# EAGLE schematic untitled (EAGLE 9.6.2)
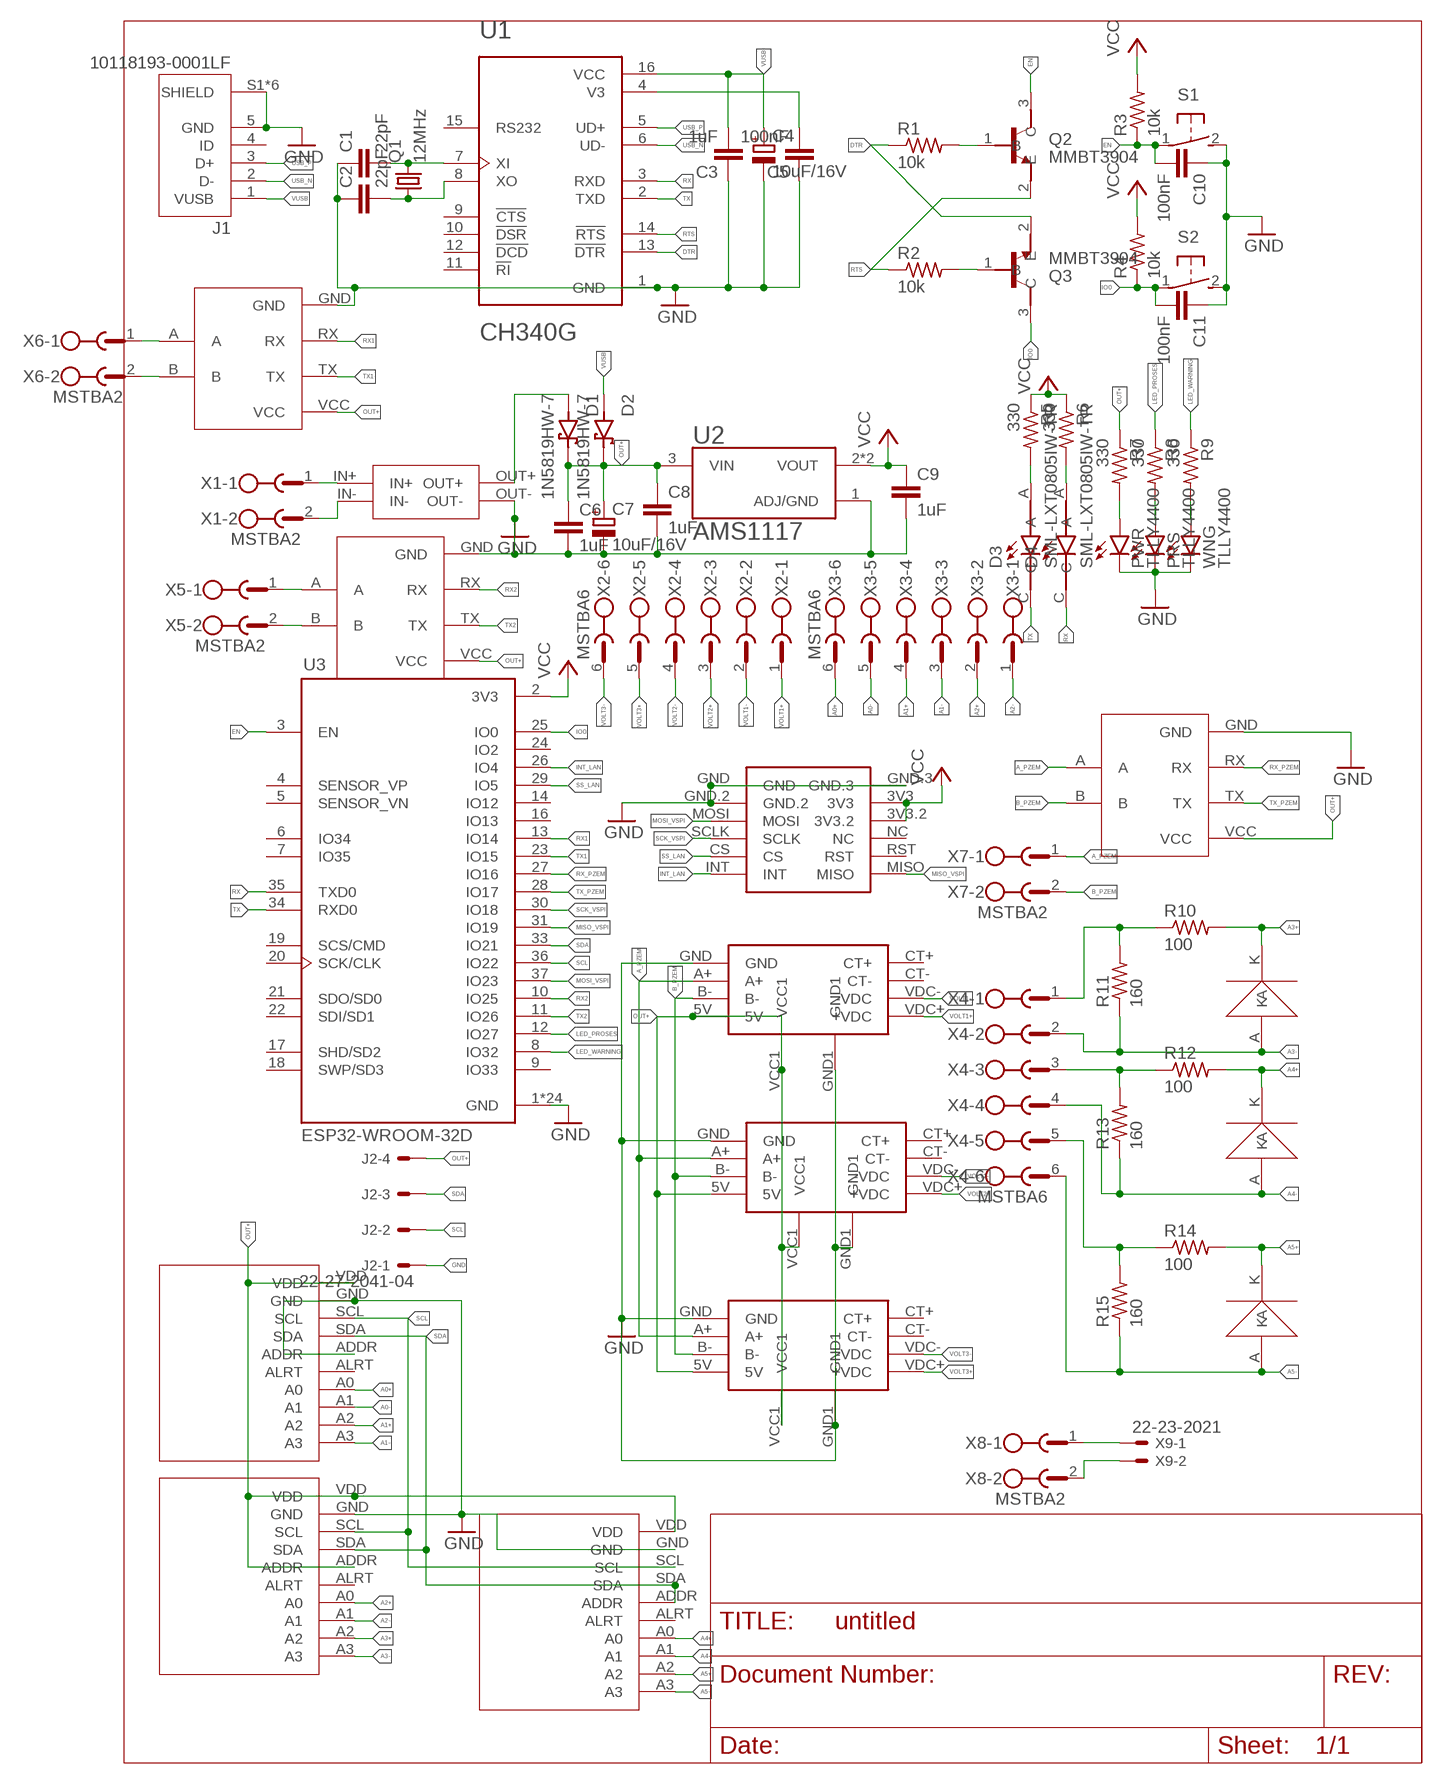
[diagram p0: schematic, sheet 1]

## Parts
ADS1  ADS1115  [ADS1115]
ADS2  ADS1115  [ADS1115]
ADS3  ADS1115  [ADS1115]
C1  22pF  C-EUC0805K  [C0805K]
C2  22pF  C-EUC0805K  [C0805K]
C3  1uF  C-EUC0805K  [C0805K]
C4  10uF/16V  CPOL-EU153CLV-0505  [153CLV-0505]
C5  100nF  C-EUC0805K  [C0805K]
C6  1uF  C-EUC0805K  [C0805K]
C7  10uF/16V  CPOL-EU153CLV-0505  [153CLV-0505]
C8  1uF  C-EUC0805K  [C0805K]
C9  1uF  C-EUC0805K  [C0805K]
C10  100nF  C-EUC0805K  [C0805K]
C11  100nF  C-EUC0805K  [C0805K]
D1  1N5819HW-7  [SOD3715X145N]
D2  1N5819HW-7  [SOD3715X145N]
D3  SML-LXT0805IW-TR  [LEDC2012X120N]
D4  SML-LXT0805IW-TR  [LEDC2012X120N]
J1  10118193-0001LF  [FCI_10118193-0001LF]
J2  22-27-2041-04  [6410-04]
MINI1  MINI560  [MINI560]
PRS  TLLY4400  [LED3MM]
PWR  TLLY4400  [LED3MM]
PZEM-DC1  PZEM-DC  [PZEM-DC]
PZEM-DC2  PZEM-DC  [PZEM-DC]
PZEM-DC3  PZEM-DC  [PZEM-DC]
Q1  12MHz  CRYSTALSM49  [SM49]
Q2  MMBT3904  [SOT95P240X120-3N]
Q3  MMBT3904  [SOT95P240X120-3N]
R1  10k  R-US_M0805  [M0805]
R2  10k  R-US_M0805  [M0805]
R3  10k  R-US_M0805  [M0805]
R4  10k  R-US_M0805  [M0805]
R5  330  R-US_M0805  [M0805]
R6  330  R-US_M0805  [M0805]
R7  330  R-US_M0805  [M0805]
R8  330  R-US_M0805  [M0805]
R9  330  R-US_M0805  [M0805]
R10  100  R-US_M0805  [M0805]
R11  160  R-US_M0805  [M0805]
R12  100  R-US_M0805  [M0805]
R13  160  R-US_M0805  [M0805]
R14  100  R-US_M0805  [M0805]
R15  160  R-US_M0805  [M0805]
S1  31-XX  [B3F-31XX]
S2  31-XX  [B3F-31XX]
TTL-RS1  TTL-RS485  [TTL-RS485]
TTL-RS2  TTL-RS485  [TTL-RS485]
TTL-RS3  TTL-RS485  [TTL-RS485]
U1  CH340G  [SOIC127P600X180-16N]
U2  AMS1117  [SOT229P700X180-4N]
U3  ESP32-WROOM-32D  [MODULE_ESP32-WROOM-32D]
U$1  MINI_W5500  [MINI_W5500]
WNG  TLLY4400  [LED3MM]
X1  MSTBA2  [MSTBA2]
X2  MSTBA6  [MSTBA6]
X3  MSTBA6  [MSTBA6]
X4  MSTBA6  [MSTBA6]
X5  MSTBA2  [MSTBA2]
X6  MSTBA2  [MSTBA2]
X7  MSTBA2  [MSTBA2]
X8  MSTBA2  [MSTBA2]
X9  22-23-2021  [22-23-2021]
ZENER3V1  3v3  ZENER3V3  [DIO_LL4148]
ZENER3V2  ZENER3V3  [DIO_LL4148]
ZENER3V3  ZENER3V3  [DIO_LL4148]

## Nets
A0+: ADS1.A0 X3.6
A0-: ADS1.A1 X3.5
A1+: ADS1.A2 X3.4
A1-: ADS1.A3 X3.3
A2+: ADS2.A0 X3.2
A2-: ADS2.A1 X3.1
A3+: ADS2.A2 R10.2 ZENER3V1.K
A3-: ADS2.A3 R11.1 X4.2 ZENER3V1.A
A4+: ADS3.A0 R12.2 ZENER3V2.K
A4-: ADS3.A1 R13.1 X4.4 ZENER3V2.A
A5+: ADS3.A2 R14.2 ZENER3V3.K
A5-: ADS3.A3 R15.1 X4.6 ZENER3V3.A
A_PZEM: PZEM-DC1.A+ PZEM-DC2.A+ PZEM-DC3.A+ TTL-RS1.A X7.1
B_PZEM: PZEM-DC1.B- PZEM-DC2.B- PZEM-DC3.B- TTL-RS1.B X7.2
DTR: Q3.2(E) R1.1 U1.13(!DTR)
EN: C10.2 Q2.3(C) R3.1 S1.1(P) U3.3(EN)
GND: ADS1.ADDR ADS1.GND ADS2.GND ADS3.GND C1.1 C2.1 C3.1 C4.- C5.1 C6.2 C7.- C8.2 C9.2 C10.1 C11.1 J1.5(GND) J1.S1(SHIELD) J1.S2(SHIELD) J1.S3(SHIELD) J1.S4(SHIELD) J1.S5(SHIELD) J1.S6(SHIELD) J2.1 MINI1.OUT- PRS.K(C) PWR.K(C) PZEM-DC1.GND PZEM-DC1.GND1 PZEM-DC2.GND PZEM-DC2.GND1 PZEM-DC3.GND PZEM-DC3.GND1 S1.2(S) S2.2(S) TTL-RS1.GND TTL-RS2.GND TTL-RS3.GND U1.1(GND) U2.1(ADJ/GND) U3.1(GND) U3.15(GND) U3.38(GND) U3.39_1(GND) U3.39_2(GND) U3.39_3(GND) U3.39_4(GND) U3.39_5(GND) U3.39_6(GND) U3.39_7(GND) U3.39_8(GND) U3.39_9(GND) U3.39_10(GND) U3.39_11(GND) U3.39_12(GND) U3.39_13(GND) U3.39_14(GND) U3.39_15(GND) U3.39_16(GND) U3.39_17(GND) U3.39_18(GND) U3.39_19(GND) U3.39_20(GND) U3.39_21(GND) U$1.GND U$1.GND.2 U$1.GND.3 WNG.K(C)
INT_LAN: U3.26(IO4) U$1.INT
IO0: C11.2 Q3.3(C) R4.1 S2.1(P) U3.25(IO0)
LED_PROSES: R8.1 U3.12(IO27)
LED_WARNING: R9.1 U3.8(IO32)
MISO_VSPI: U3.31(IO19) U$1.MISO
MOSI_VSPI: U3.37(IO23) U$1.MOSI
N$1: C1.2 Q1.2 U1.7(XI)
N$2: C2.2 Q1.1 U1.8(XO)
N$3: MINI1.IN+ X1.1
N$4: C5.2 U1.4(V3)
N$5: MINI1.IN- X1.2
N$6: Q2.1(B) R1.2
N$7: Q3.1(B) R2.2
N$8: D1.A MINI1.OUT+
N$9: R10.1 R11.2 X4.1
N$10: D3.A R5.2
N$11: D4.A R6.2
N$12: PWR.A R7.2
N$13: PRS.A R8.2
N$14: R9.2 WNG.A
N$15: TTL-RS2.A X6.1
N$16: TTL-RS2.B X6.2
N$17: X8.1 X9.1
N$18: X8.2 X9.2
N$21: R12.1 R13.2 X4.3
N$22: TTL-RS3.A X5.1
N$23: TTL-RS3.B X5.2
N$24: R14.1 R15.2 X4.5
OUT+: ADS1.VDD ADS2.ADDR ADS2.VDD ADS3.VDD C6.1 C7.+ C8.1 D1.C(K) D2.C(K) J2.4 PZEM-DC1.5V PZEM-DC1.VCC1 PZEM-DC2.5V PZEM-DC2.VCC1 PZEM-DC3.5V PZEM-DC3.VCC1 R7.1 TTL-RS1.VCC TTL-RS2.VCC TTL-RS3.VCC U2.3(VIN)
RTS: Q2.2(E) R2.1 U1.14(!RTS)
RX: D4.C U1.3(RXD) U3.35(TXD0)
RX1: TTL-RS2.RX U3.13(IO14)
RX2: TTL-RS3.RX U3.10(IO25)
RX_PZEM: TTL-RS1.RX U3.27(IO16)
SCK_VSPI: U3.30(IO18) U$1.SCLK
SCL: ADS1.SCL ADS2.SCL ADS3.SCL J2.2 U3.36(IO22)
SDA: ADS1.SDA ADS2.SDA ADS3.ADDR ADS3.SDA J2.3 U3.33(IO21)
SS_LAN: U3.29(IO5) U$1.CS
TX: D3.C U1.2(TXD) U3.34(RXD0)
TX1: TTL-RS2.TX U3.23(IO15)
TX2: TTL-RS3.TX U3.11(IO26)
TX_PZEM: TTL-RS1.TX U3.28(IO17)
USB_N: J1.2(D-) U1.6(UD-)
USB_P: J1.3(D+) U1.5(UD+)
VCC: C9.1 R3.2 R4.2 R5.1 R6.1 U2.2(VOUT) U2.4(VOUT) U3.2(3V3) U$1.3V3 U$1.3V3.2
VOLT1+: PZEM-DC1.VDC+(+VDC) X2.1
VOLT1-: PZEM-DC1.VDC-(-VDC) X2.2
VOLT2+: PZEM-DC2.VDC+(+VDC) X2.3
VOLT2-: PZEM-DC2.VDC-(-VDC) X2.4
VOLT3+: PZEM-DC3.VDC+(+VDC) X2.5
VOLT3-: PZEM-DC3.VDC-(-VDC) X2.6
VUSB: C3.2 C4.+ D2.A J1.1(VUSB) U1.16(VCC)
Unconnected: ADS1.ALRT ADS2.ALRT ADS3.ALRT J1.4(ID) PZEM-DC1.CT+ PZEM-DC1.CT- PZEM-DC2.CT+ PZEM-DC2.CT- PZEM-DC3.CT+ PZEM-DC3.CT- U1.9(!CTS) U1.10(!DSR) U1.11(!RI) U1.12(!DCD) U1.15(RS232) U3.4(SENSOR_VP) U3.5(SENSOR_VN) U3.6(IO34) U3.7(IO35) U3.9(IO33) U3.14(IO12) U3.16(IO13) U3.17(SHD/SD2) U3.18(SWP/SD3) U3.19(SCS/CMD) U3.20(SCK/CLK) U3.21(SDO/SD0) U3.22(SDI/SD1) U3.24(IO2) U$1.NC U$1.RST

## Library data of the parts
ADS1-ADS3 = ds1115:ADS1115
C1-C3 C5 C6 C8-C11 = rcl:C-EU: CAPACITOR, European symbol; SPICEPREFIX: C
C4 C7 = rcl:CPOL-EU: POLARIZED CAPACITOR, European symbol; SPICEPREFIX: C
D1 D2 = 1N5819HW-7:1N5819HW-7: 1N5819HW Series 40 V 1 A Surface Mount Schottky Barrier Rectifier - SOD-123 Check availability <https://pricing.snapeda.com/parts/1N5819HW-7/Diodes%20Inc./view-part?ref=eda>; AVAILABILITY: In Stock; DESCRIPTION: Diode Schottky 40 V 1A Surface Mount SOD-123; MF: Diodes Inc.; MP: 1N5819HW-7; PACKAGE: SOD-123 Fairchild Semiconductor; PRICE: None; PURCHASE-URL: https://pricing.snapeda.com/search/part/1N5819HW-7/?ref=eda
D3 D4 = SML-LXT0805IW-TR:SML-LXT0805IW-TR: LED; Luminous Intensity:11µcd; Viewing Angle:140°; Forward Current:30mA; Forward Voltage:2V; Color:Red; LED Color:Red; Leaded Process Compatible:Yes; Lens Color:White; Mounting Type:Surface Mount ;RoHS Compliant: Yes Check availability <https://pricing.snapeda.com/parts/SML-LXT0805IW-TR/Lumex%20Opto/Components/view-part?ref=eda>; AVAILABILITY: In Stock; DESCRIPTION: Red - LED Indication - Discrete 2V 0805 (2012 Metric); MF: Lumex Opto/Components; MP: SML-LXT0805IW-TR; PACKAGE: 0805 Lumex; PRICE: None; PURCHASE-URL: https://pricing.snapeda.com/search/part/SML-LXT0805IW-TR/?ref=eda
J1 = 10118193-0001LF:10118193-0001LF: Micro USB B Type Receptacle Check availability <https://pricing.snapeda.com/parts/10118193-0001LF/FCI/view-part?ref=eda>; AVAILABILITY: In Stock; DESCRIPTION: USB - micro B USB 2.0 Receptacle Connector 5 Position Surface Mount, Right Angle; Through Hole; MF: FCI; MP: 10118193-0001LF; PACKAGE: None; PRICE: None; PURCHASE-URL: https://pricing.snapeda.com/search/part/10118193-0001LF/?ref=eda
J2 = con-molex:22-?-04: CONNECTOR wire to board 2.54 mm (.1 inch) pitch header; MF: MOLEX; OC_FARNELL: unknown; OC_NEWARK: unknown
MINI1 = MINI560:MINI560
PRS PWR WNG = led:TLLY4400: Low Current (2mA) LED 3 mm Tinted Diffused Package color YELLOW Source: Data sheet <http://www.farnell.com/datasheets/391098.pdf>; MF: VISHAY SEMICONDUCTOR; OC_FARNELL: 1612439
PZEM-DC1-PZEM-DC3 = pzem-dc:PZEM-DC
Q1 = crystal:CRYSTAL: CRYSTAL; OC_FARNELL: unknown; OC_NEWARK: unknown
Q2 Q3 = MMBT3904:MMBT3904: MMBT3904 Series 40 V CE Breakdown 0.2 A NPN General Purpose Amplifier - SOT-23 Check availability <https://pricing.snapeda.com/parts/MMBT3904/ON%20Semiconductor/view-part?ref=eda>; AVAILABILITY: In Stock; DESCRIPTION: Bipolar (BJT) Transistor NPN 40 V 200 mA 300MHz 300 mW Surface Mount SOT-23-3 (TO-236); MF: ON Semiconductor; MP: MMBT3904; PACKAGE: SOT-23-3 Motorola; PRICE: None
R1-R15 = rcl:R-US_: RESISTOR, American symbol; SPICEPREFIX: R
S1 S2 = switch-omron:31-XX: OMRON SWITCH; MPN: B3F-3100; OC_FARNELL: 959704; OC_NEWARK: 36M3582
TTL-RS1-TTL-RS3 = TTL-RS485:TTL-RS485
U1 = CH340G:CH340G: Check availability <https://pricing.snapeda.com/parts/Ch340G/WCH/view-part?ref=eda>; AVAILABILITY: Not in stock; DESCRIPTION: USB Interface Integrated Circuit; MF: WCH; MP: Ch340G; PACKAGE: None; PRICE: None
U2 = AMS1117:AMS1117: Sot223/Pkg 1-Amp 5-Volt Low Drop Out Voltage Regulatator Check availability <https://pricing.snapeda.com/parts/AMS1117/Advanced%20Monolithic%20Systems/view-part?ref=eda>; AVAILABILITY: Not in stock; DESCRIPTION: 1A LOW DROPOUT VOLTAGE REGULATOR SOT-223; MF: Advanced Monolithic Systems; MP: AMS1117; PACKAGE: SOT-223 Seeed Technology; PRICE: None
U3 = ESP32-WROOM-32D:ESP32-WROOM-32D: Bluetooth, WiFi 802.11b/g/n, Bluetooth v4.2 + EDR, Class 1, 2 and 3 Transceiver Module 2.4GHz ~ 2.5GHz Integrated, Trace Surface Mount Check availability <https://pricing.snapeda.com/parts/ESP32-WROOM-32D/Espressif%20Systems/view-part?ref=eda>; AVAILABILITY: In Stock; DESCRIPTION: Bluetooth, WiFi 802.11b/g/n, Bluetooth v4.2 +EDR, Class 1, 2 and 3 Transceiver Module 2.4GHz ~ 2.5GHz Integrated; MF: Espressif Systems; MP: ESP32-WROOM-32D; PACKAGE: Module Espressif Systems; PRICE: None; PURCHASE-URL: https://pricing.snapeda.com/search/part/ESP32-WROOM-32D/?ref=eda
U$1 = ethernet-mikroavr:MINI_W5500: MINI ETHERNET W5500, CREATE BY MIKROAVR.COM
X1 X5-X8 = con-phoenix-508:MSTBA2: PHOENIX; MF: FARNELL; MPN: 1757242; OC_FARNELL: 3705171; OC_NEWARK: 71C4161
X2-X4 = con-phoenix-508:MSTBA6: PHOENIX; MF: FARNELL; MPN: 1757284; OC_FARNELL: 3705213; OC_NEWARK: 71C4165
X9 = con-molex:22-23-2021: .100" (2.54mm) Center Header - 2 Pin; MF: MOLEX; MPN: 22-23-2021; OC_FARNELL: 1462926; OC_NEWARK: 25C3832
ZENER3V1-ZENER3V3 = ZENER3V3:ZENER3V3